# EasyEDA Pro project Daul Power Supply.eprj

# Schematic Dual Power Supply
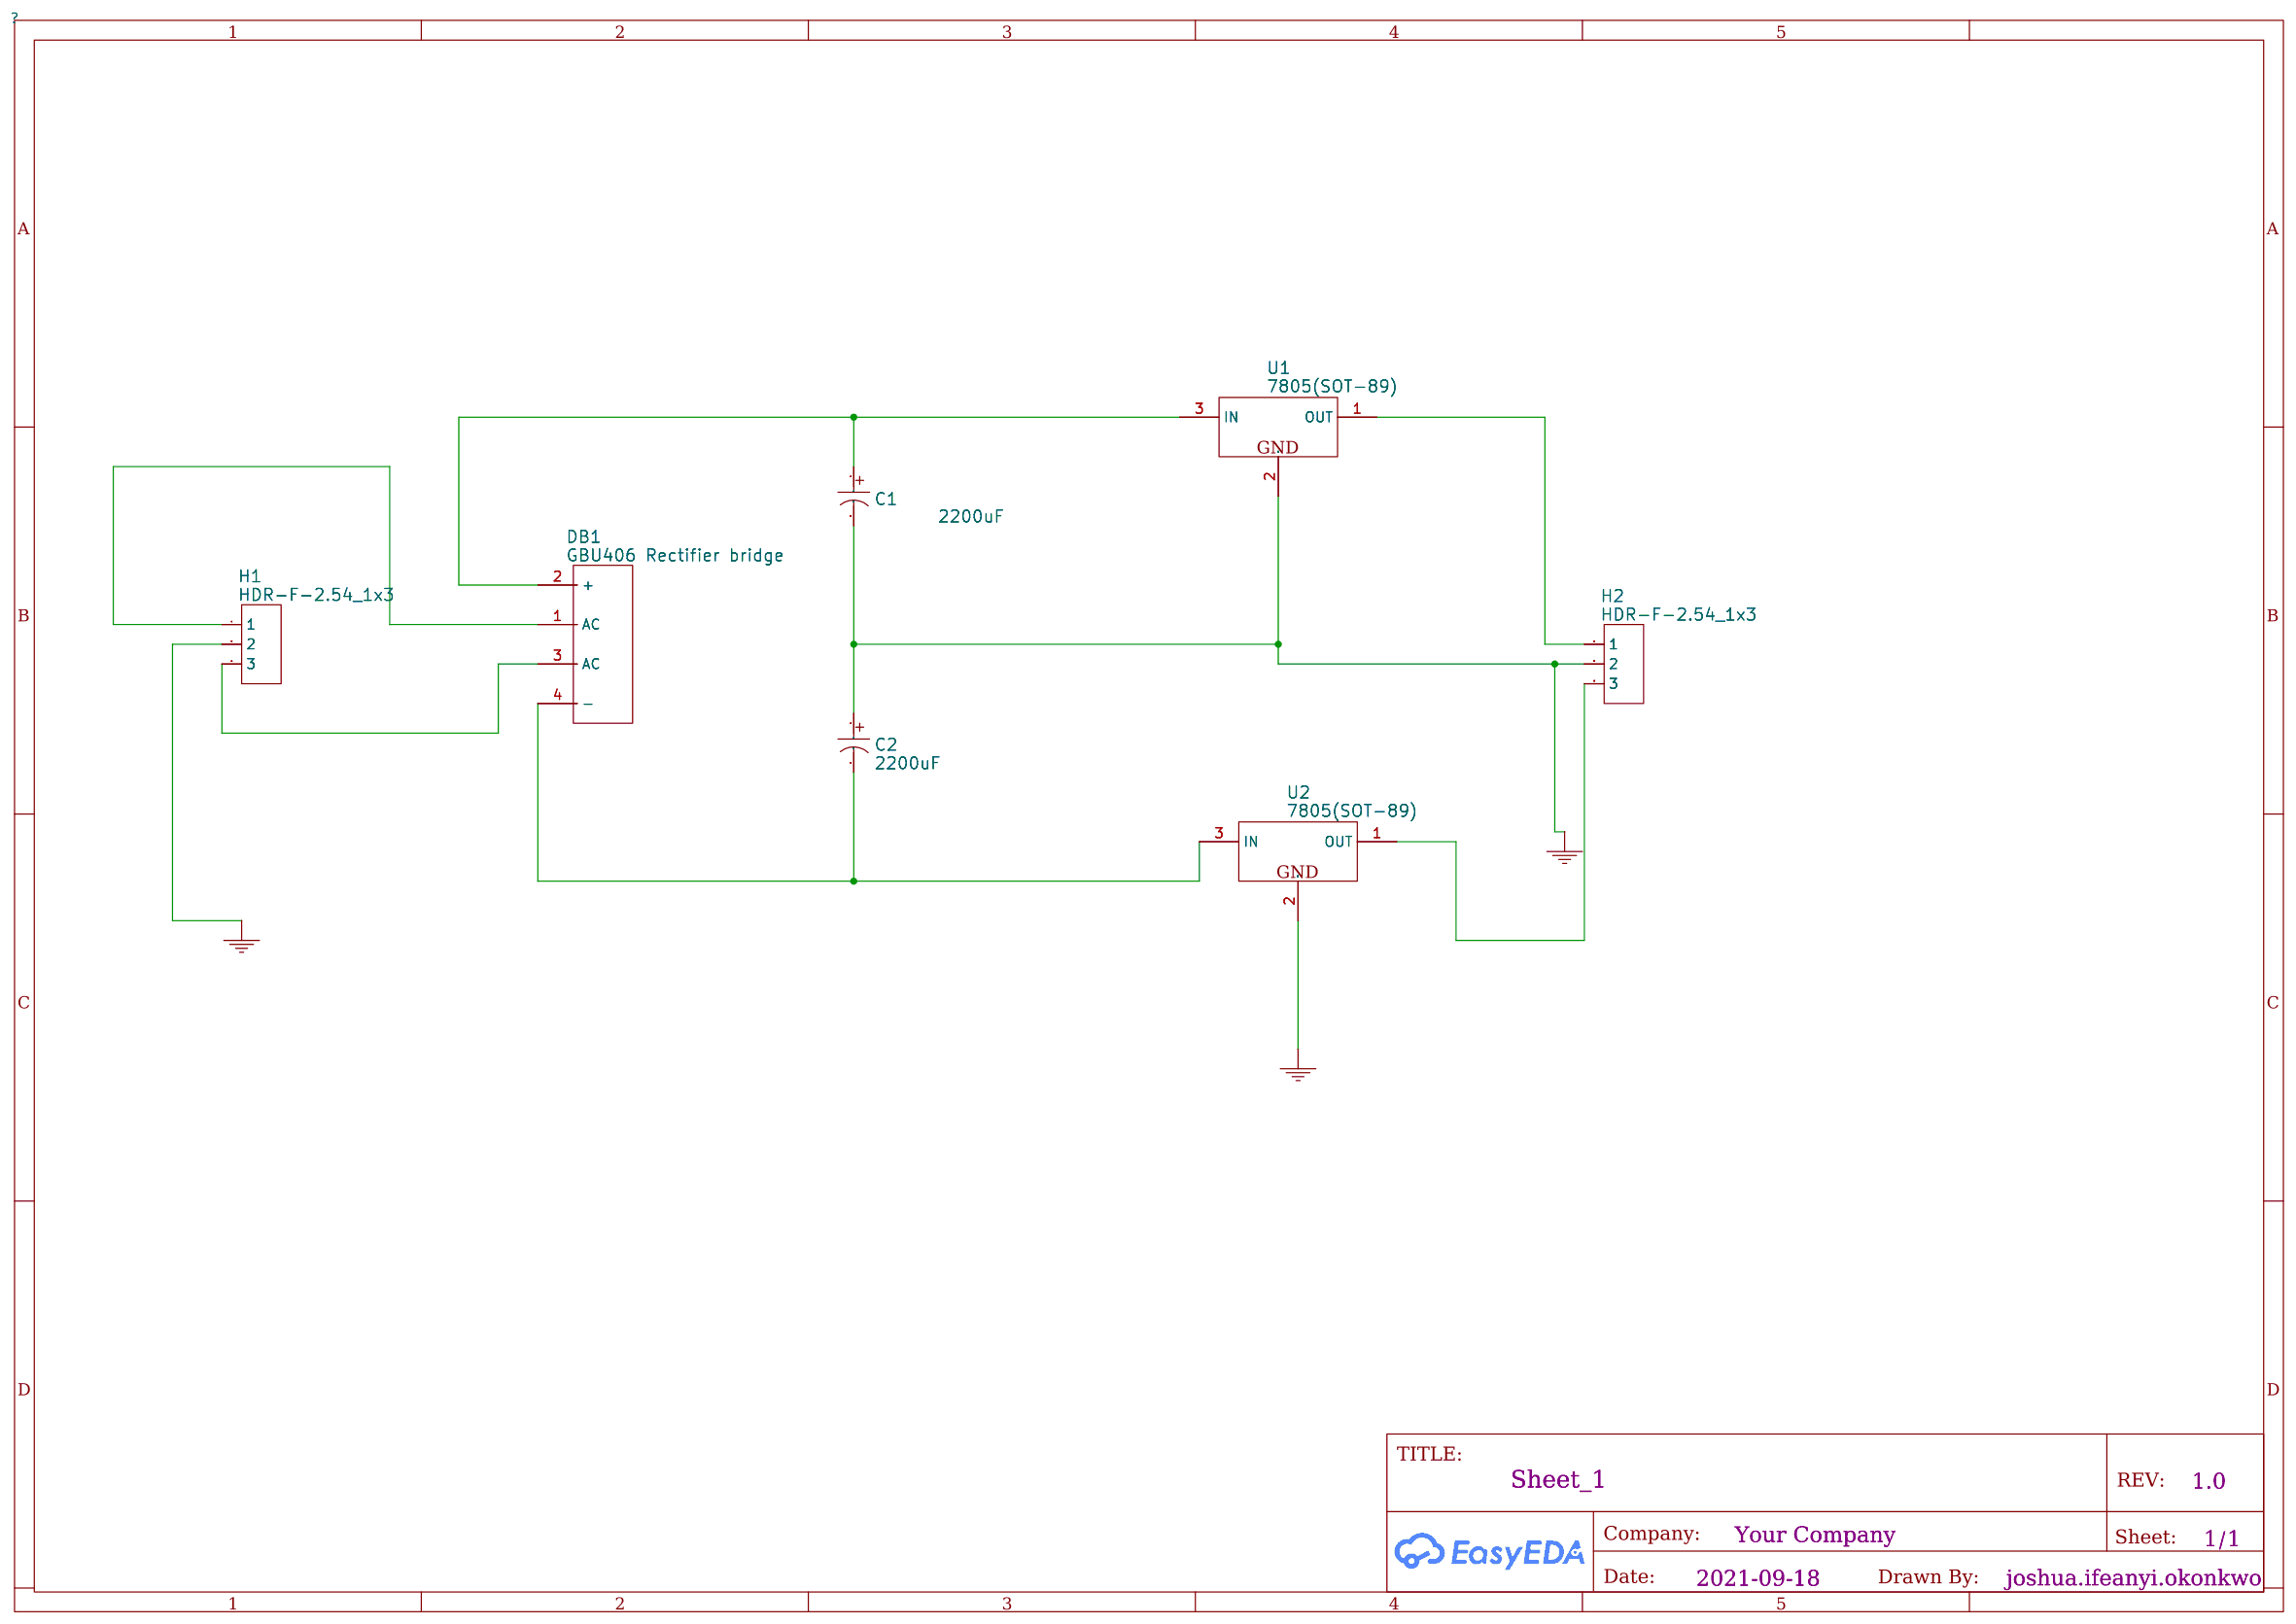
[diagram p0: schematic sheet]

## Parts
C1  2200uF
C2  2200uF
DB1  GBU406 Rectifier bridge
H1  HDR-F-2.54_1x3
H2  HDR-F-2.54_1x3
U1  7805(SOT-89)
U2  7805(SOT-89)

## Library data of the parts
C1 C2 = 2200uF: Supplier: LCSC; Manufacturer: CX(承兴); Manufacturer Part: KM228M025J20RR0VH2FP0; Supplier Part: C44598; JLCPCB Part Class: Extended Part; link: https://lcsc.com/eda_search?q=C44598&amp;%26type=1&amp;ref=editor
DB1 = GBU406 Rectifier bridge: Supplier: LCSC; Manufacturer: MDD; Manufacturer Part: GBU406; Supplier Part: C13432; JLCPCB Part Class: Extended Part; link: https://lcsc.com/eda_search?q=C13432&amp;%26type=1&amp;ref=editor
H1 H2 = HDR-F-2.54_1x3: Supplier Part: C146690; Supplier: LCSC
U1 U2 = 7805(SOT-89): Supplier: LCSC; Manufacturer: CJ; Manufacturer Part: CJ78L05; image: //image.lceda.cn/szlcsc/C2079.jpg; Supplier Part: C2079; Paste Type: expand

## Nets
GND: C1.2 C2.1 H1.2 H2.2 U1.2(GND) U2.2(GND)
Net-(C1-1): C1.1 DB1.2(+) U1.3(IN)
Net-(C2-2): C2.2 DB1.4(-) U2.3(IN)
Net-(DB1-1): DB1.1(AC) H1.1
Net-(DB1-3): DB1.3(AC) H1.3
Net-(H2-1): H2.1 U1.1(OUT)
Net-(H2-3): H2.3 U2.1(OUT)
